# EasyEDA schematic SCH_IoT_Weather_Station_With_Air_Quality_Monitor_2022-09-14.json
TITLE: IoT Weather Station With Air Quality Monitor; REV: 1.0; Date: 2022-09-14; Sheet: 1/1; Drawn By: bmmbmanevski; Company: Branislav Manevski
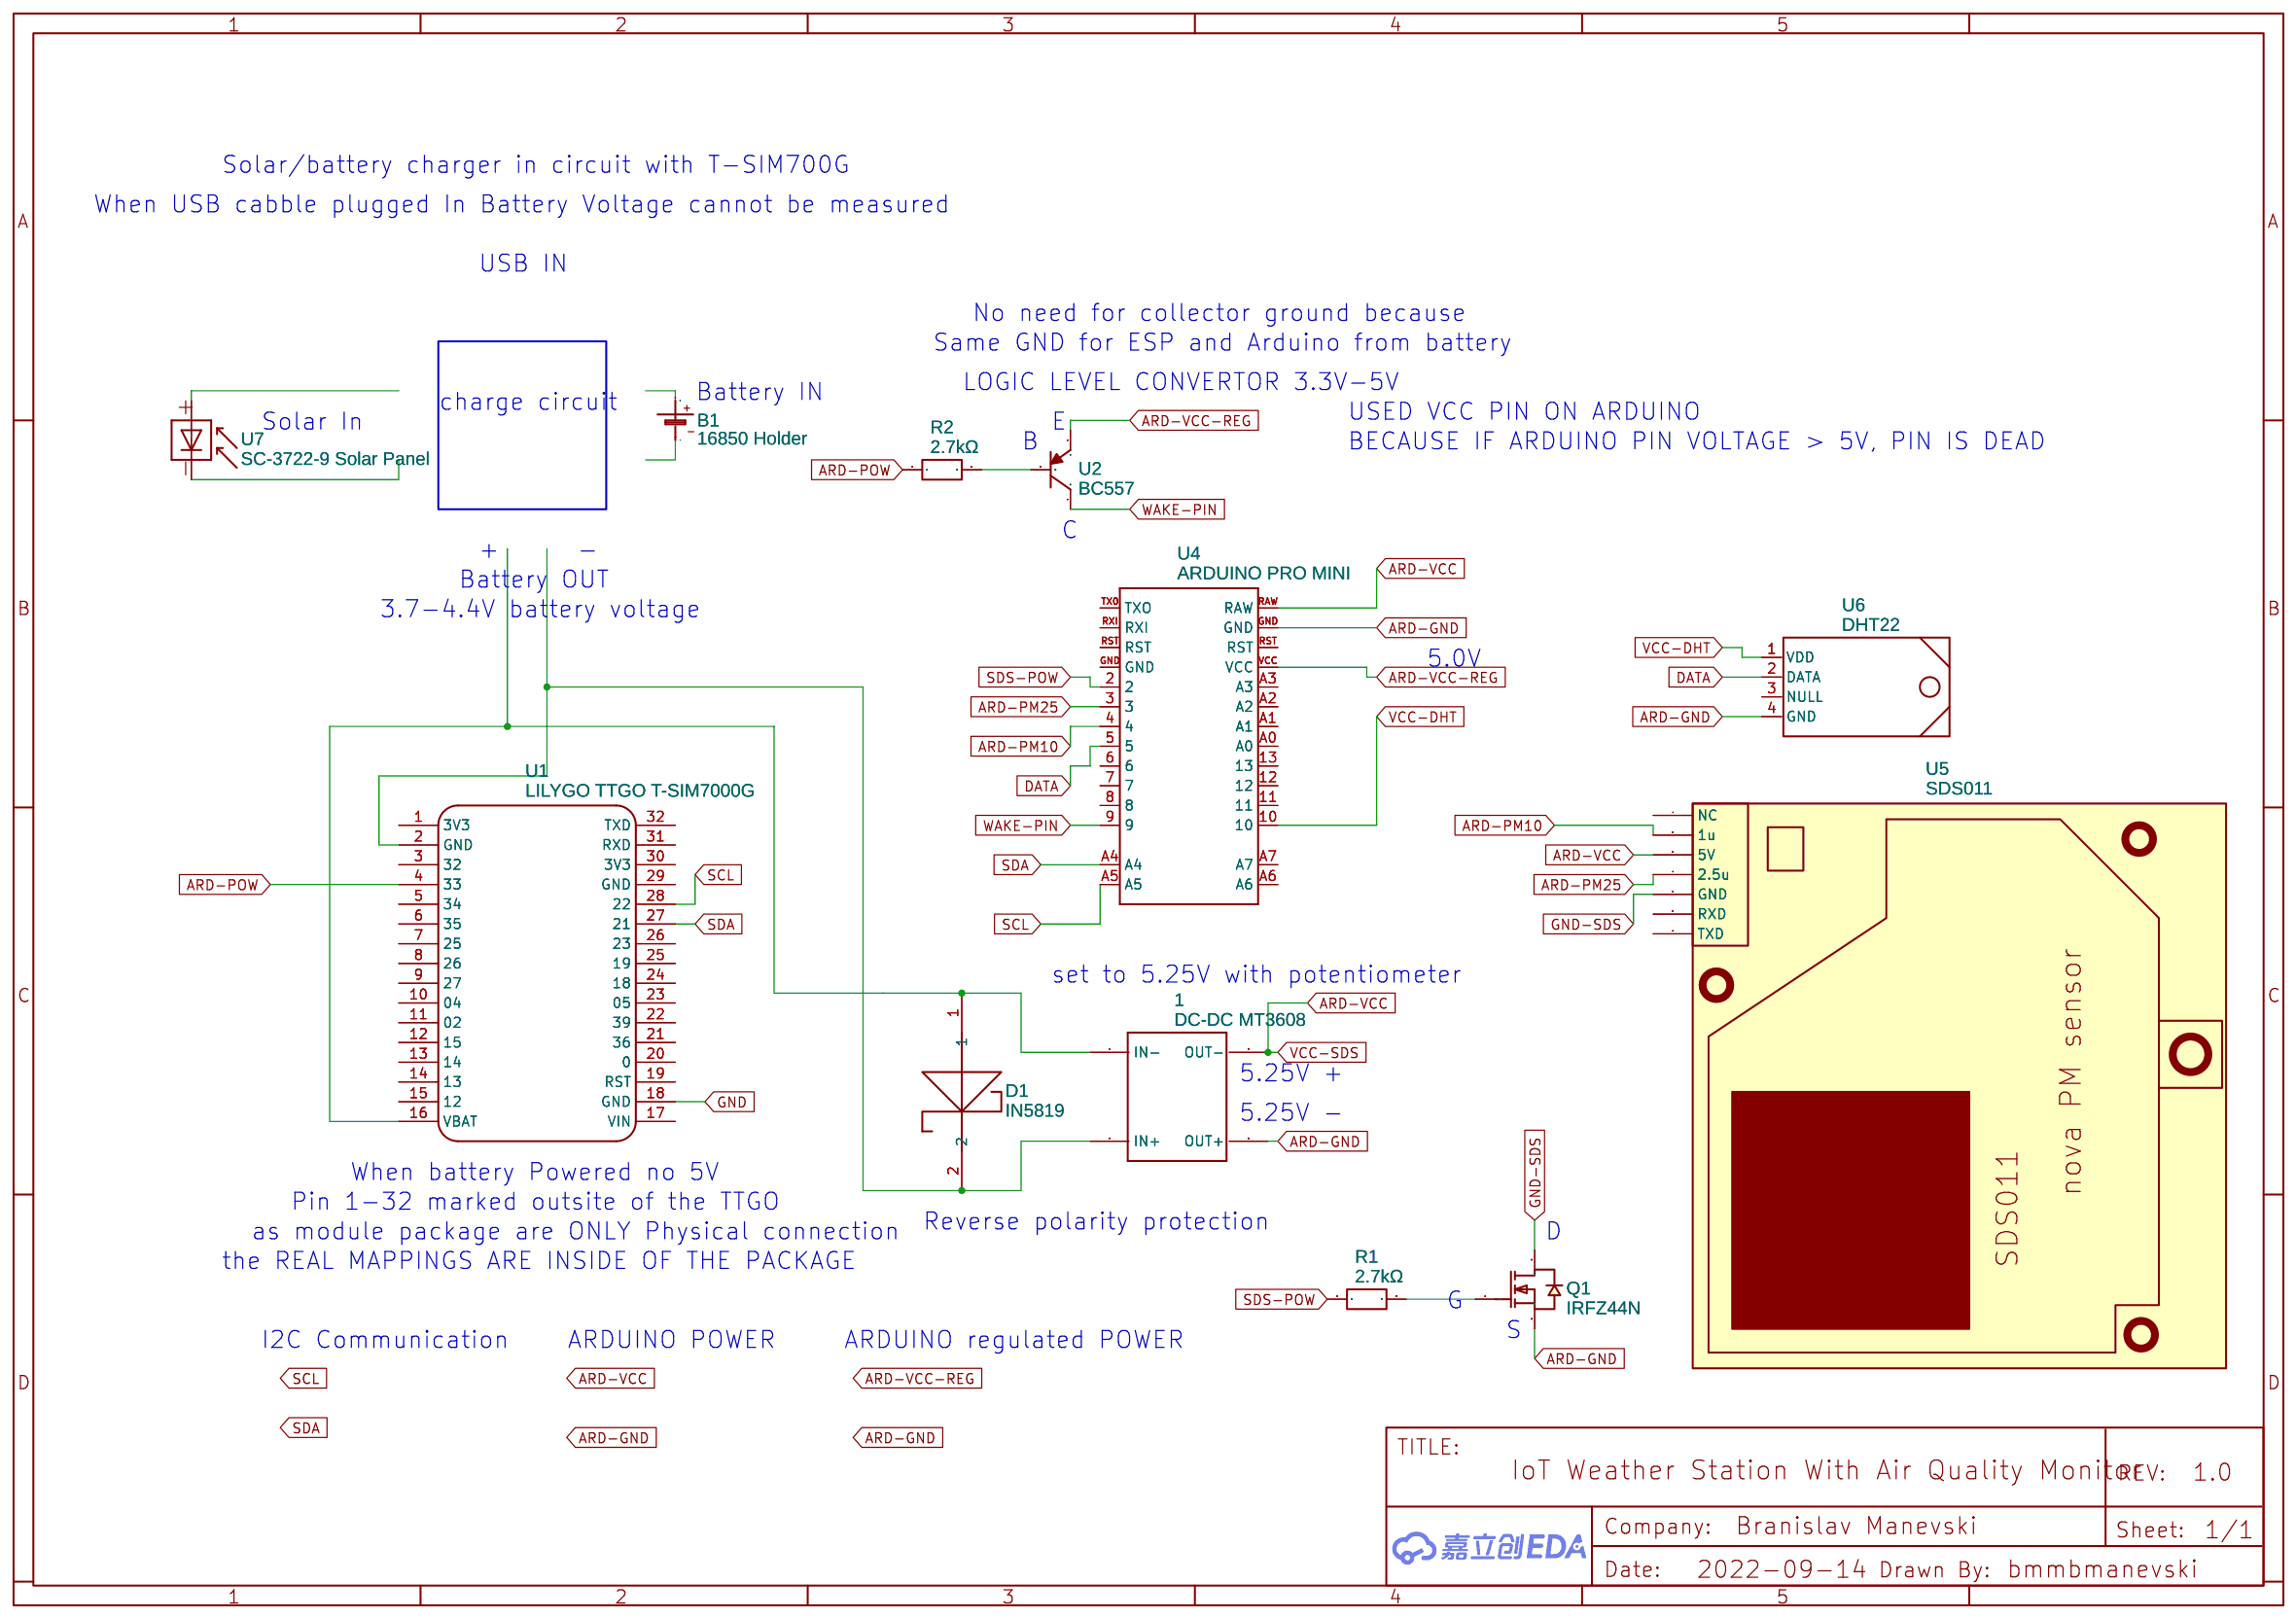
[diagram p0: schematic sheet]

## Parts
1  DC-DC MT3608  [DC-DC-STEP-UP-MT3608]
B1  16850 Holder  [BH-18650-A]
D1  IN5819  [SMA(DO-214AC)]
Q1  IRFZ44N  [TO-220-3_L10.0-W4.5-P2.54-L]
R1  2.7kΩ  [R0402]
R2  2.7kΩ  [R0402]
U1  LILYGO TTGO T-SIM7000G  [LILYGO TTGO T-SIM7000G]
U2  BC557  [BC557 TO92]
U4  ARDUINO PRO MINI  [ARDUINO_PRO_MINI PRO]
U5  SDS011  [SDS011]
U6  DHT22  [DHT22]
U7  SC-3722-9 Solar Panel  [SC-3722-9 SOLAR PANEL]

## Library data of the parts
1 = DC-DC MT3608: Contributor: jayds199
B1 = 16850 Holder: Contributor: bcpersada
D1 = IN5819: Manufacturer Part: CDBA240LL-HF; Contributor: fmarquis; Supplier Part: 641-1698-1-ND; Supplier: Digi-Key; link: https://www.digikey.ca/products/en?keywords=641-1698-1-nd
Q1 = IRFZ44N: Supplier: LCSC; Manufacturer: IR; Manufacturer Part: IRFZ44NPBF; image: //image.lceda.cn/szlcsc/C2586.jpg; Supplier Part: C2586; Contributor: Serega180274
R1 R2 = 0402WGD2701TCE: Supplier: LCSC; Supplier Part: C423290; Manufacturer: Uniroyal Elec; Resistance (Ohms): 2.7K; Contributor: LCSC; JLCPCB Part Class: Extended Part
U1 = LILYGO TTGO T-SIM7000G: Contributor: mhasnat0
U2 = BC557: Contributor: Betech_GrTeam
U4 = ARDUINO PRO MINI: Contributor: SparkFun
U5 = SDS011: Supplier: AdaFruit; link: https://nettigo.eu/products/nova-fitnes-sds011-air-quality-sensor; Contributor: chrisgamma
U6 = DHT22: Contributor: Jakub Czarny
U7 = SC-3722-9 Solar Panel: Manufacturer: VIMUN; Manufacturer Part: SC-3722-9; Supplier Part: SC-3722-9; link: http://www.vimun.cn/en/ProductInfo.asp?pid=17; Contributor: nikolacollins

## Nets
GND: U1.18(GND)
GND-SDS: Q1.2(D) U5.3(GND)
VCC-DHT: U4.10 U6.1(VDD)
ARD-GND: 1.OUT+ Q1.3(S) U4.GND U6.4(GND)
ARD-PM10: U4.4 U5.6(1u)
ARD-PM25: U4.3 U5.4(2.5u)
ARD-POW: R2.1 U1.4(33)
ARD-VCC: 1.OUT- U4.RAW U5.5(5V)
ARD-VCC-REG: U2.3(E) U4.VCC
DATA: U4.5 U6.2(DATA)
SCL: U1.28(22) U4.A5
SDA: U1.27(21) U4.A4
SDS-POW: R1.1 U4.2
WAKE-PIN: U2.1(C) U4.9
Net-(1-IN+): 1.IN+ D1.2 U1.2(GND)
Net-(1-IN-): 1.IN- D1.1 U1.16(VBAT)
Net-(Q1-1): Q1.1(G) R1.2
Net-(R2-2): R2.2 U2.2(B)

Not connected (* = marked no-connect by the designer): B1 1(+) 2(-); U1 1(3V3) 3(32) 5(34) 6(35) 7(25) 8(26) 9(27) 10(04) 11(02) 12(15) 13(14) 14(13) 15(12) 17(VIN) 19(RST) 20(0) 21(36) 22(39) 23(05) 24(18) 25(19) 26(23) 29(GND) 30(3V3) 31(RXD) 32(TXD); U4 6 7 8 11 12 13 A0 A1 A2 A3 A6 A7 RST RXI TX0(TXO); U5 1(TXD) 2(RXD) 7(NC); U6 3(NULL); U7 +(A) -(C)

## Notes on the sheet
- Solar/battery charger in circuit with T-SIM700G
- When USB cabble plugged In Battery Voltage cannot be measured
- USB IN
- No need for collector ground because
- Same GND for ESP and Arduino from battery
- LOGIC LEVEL CONVERTOR 3.3V-5V
- charge circuit
- Battery IN
- Solar In
- E
- USED VCC PIN ON ARDUINO
- B
- BECAUSE IF ARDUINO PIN VOLTAGE > 5V, PIN IS DEAD
- C
- +
- -
- Battery OUT
- 3.7-4.4V battery voltage
- 5.0V
- set to 5.25V with potentiometer
- 5.25V +
- 5.25V -
- When battery Powered no 5V
- Pin 1-32 marked outsite of the TTGO
- Reverse polarity protection
- as module package are ONLY Physical connection
- D
- the REAL MAPPINGS ARE INSIDE OF THE PACKAGE
- G
- I2C Communication
- ARDUINO POWER
- ARDUINO regulated POWER
- S
